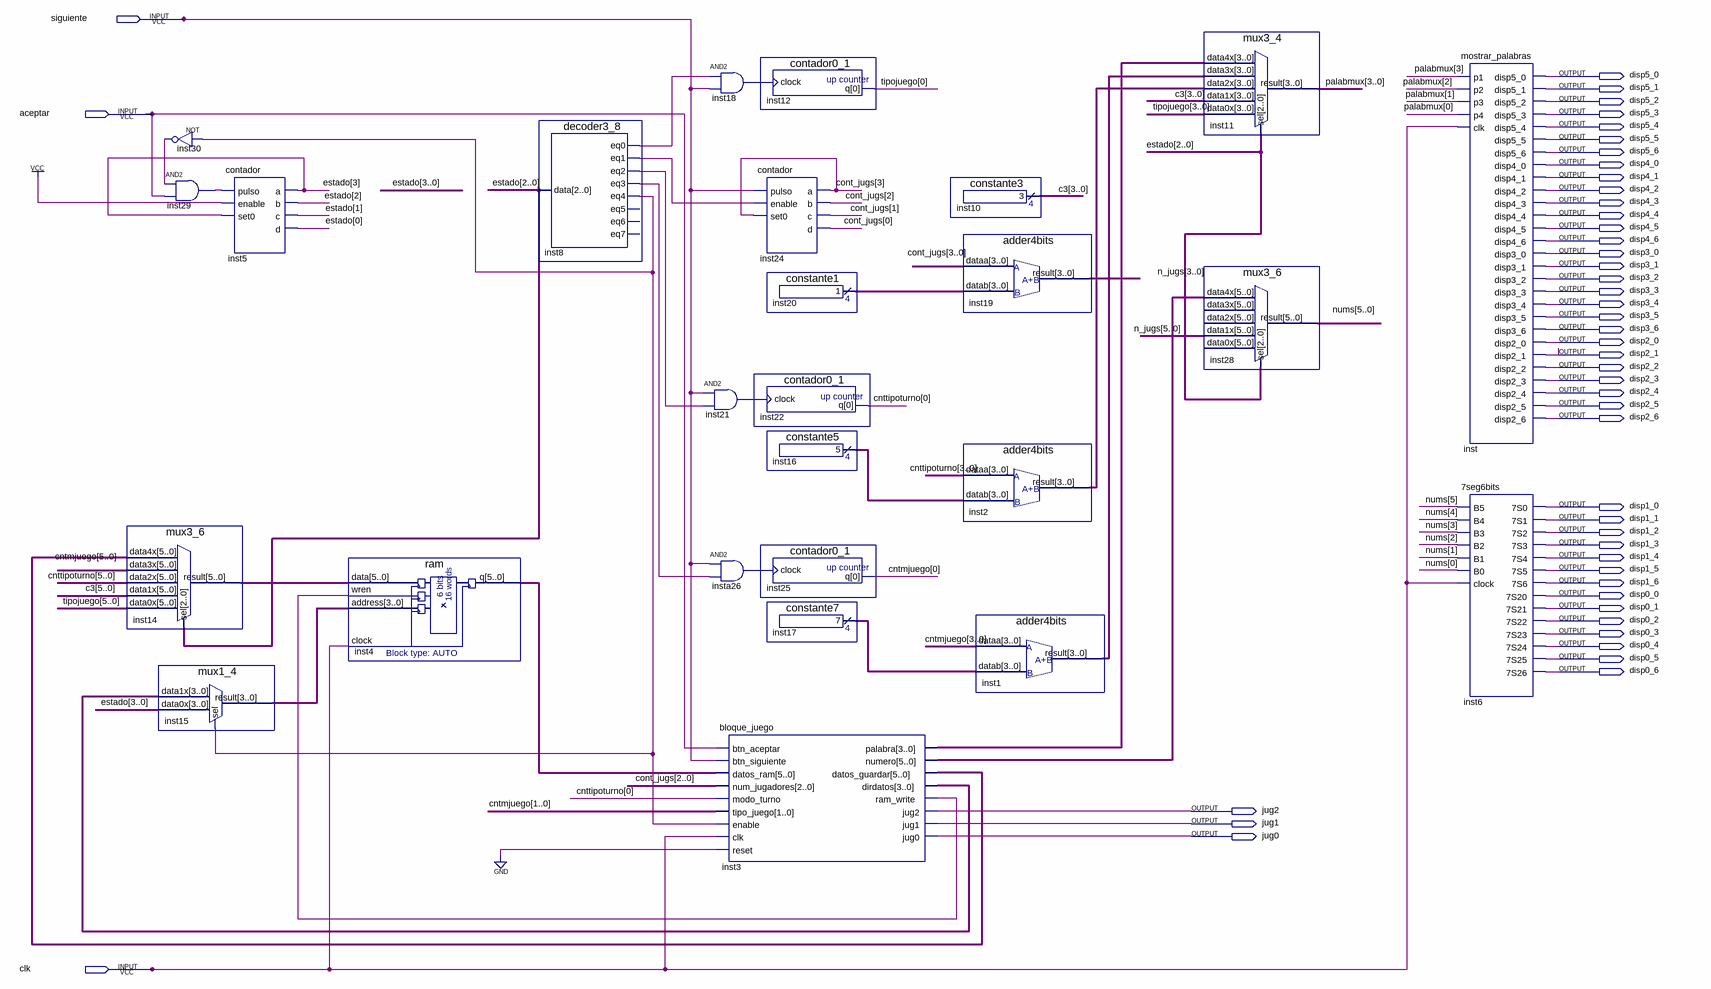
[diagram p0: schematic sheet]
// Quartus schematic asistente.bdf as structural Verilog: 26 symbols, 48 pins
module asistente (
  input  siguiente,
  input  aceptar,
  input  clk,
  output disp5_0,
  output disp5_1,
  output disp5_2,
  output disp5_3,
  output disp5_4,
  output disp5_5,
  output disp5_6,
  output disp4_0,
  output disp4_1,
  output disp4_2,
  output disp4_3,
  output disp4_4,
  output disp4_5,
  output disp4_6,
  output disp3_0,
  output disp3_1,
  output disp3_2,
  output disp3_3,
  output disp3_4,
  output disp3_5,
  output disp3_6,
  output disp2_0,
  output disp2_1,
  output disp2_2,
  output disp2_3,
  output disp2_4,
  output disp2_5,
  output disp2_6,
  output disp1_0,
  output disp1_1,
  output disp1_2,
  output disp1_3,
  output disp1_4,
  output disp1_5,
  output disp1_6,
  output disp0_0,
  output disp0_1,
  output disp0_2,
  output disp0_3,
  output disp0_4,
  output disp0_5,
  output disp0_6,
  output jug2,
  output jug1,
  output jug0
);

  wire inst3_ram_write, inst8_eq0, inst8_eq1, inst8_eq2, inst8_eq3, inst8_eq4, inst18_out, inst21_out,
       inst29_out, inst30_out, insta26_out;
  wire [3:0] cont_jugs, estado, inst1_result, inst2_result, inst3_dirdatos, inst3_palabra, inst15_result,
       inst16_result, inst17_result, inst20_result, palabmux;
  wire [5:0] c3, cntmjuego, cnttipoturno, inst3_datos_guardar, inst3_numero, inst4_q, inst14_result, n_jugs,
       nums, tipojuego;

  mux3_6 inst14 (
    .data4x(inst3_datos_guardar), .data3x(cntmjuego), .data2x(cnttipoturno), .data1x(c3), .data0x(tipojuego),
    .sel(estado[2:0]), .result(inst14_result));
  not inst30 (inst30_out, inst8_eq4);
  and inst29 (inst29_out, inst30_out, aceptar);
  mux1_4 inst15 (.data1x(inst3_dirdatos), .data0x(estado), .sel(inst8_eq4), .result(inst15_result));
  contador inst5 (
    .pulso(inst29_out), .enable(1'b1), .set0(estado[3]), .a(estado[3]), .b(estado[2]), .c(estado[1]),
    .d(estado[0]));
  ram inst4 (.data(inst14_result), .wren(inst3_ram_write), .address(inst15_result), .clock(clk), .q(inst4_q));
  decoder3_8 inst8 (
    .data(estado[2:0]), .eq0(inst8_eq0), .eq1(inst8_eq1), .eq2(inst8_eq2), .eq3(inst8_eq3), .eq4(inst8_eq4));  // open: eq5, eq6, eq7
  and inst21 (inst21_out, siguiente, inst8_eq2);
  and inst18 (inst18_out, inst8_eq0, siguiente);
  contador inst24 (
    .pulso(siguiente), .enable(inst8_eq1), .set0(cont_jugs[3]), .a(cont_jugs[3]), .b(cont_jugs[2]),
    .c(cont_jugs[1]), .d(cont_jugs[0]));
  contador0_1 inst22 (.clock(inst21_out), .q(cnttipoturno[0]));
  and insta26 (insta26_out, siguiente, inst8_eq3);
  bloque_juego inst3 (
    .btn_aceptar(aceptar), .btn_siguiente(siguiente), .datos_ram(inst4_q), .num_jugadores(cont_jugs[2:0]),
    .modo_turno(cnttipoturno[0]), .tipo_juego(cntmjuego[1:0]), .enable(inst8_eq4), .clk(clk), .reset(1'b0),
    .palabra(inst3_palabra), .numero(inst3_numero), .datos_guardar(inst3_datos_guardar),
    .dirdatos(inst3_dirdatos), .ram_write(inst3_ram_write), .jug2(jug2), .jug1(jug1), .jug0(jug0));
  contador0_1 inst12 (.clock(inst18_out), .q(tipojuego[0]));
  constante1 inst20 (.result(inst20_result));
  constante5 inst16 (.result(inst16_result));
  contador0_1 inst25 (.clock(insta26_out), .q(cntmjuego[0]));
  constante7 inst17 (.result(inst17_result));
  constante3 inst10 (.result(c3[3:0]));
  adder4bits inst19 (.dataa(cont_jugs), .datab(inst20_result), .result(n_jugs[3:0]));
  adder4bits inst2 (.dataa(cnttipoturno[3:0]), .datab(inst16_result), .result(inst2_result));
  adder4bits inst1 (.dataa(cntmjuego[3:0]), .datab(inst17_result), .result(inst1_result));
  mux3_4 inst11 (
    .data4x(inst3_palabra), .data3x(inst1_result), .data2x(inst2_result), .data1x(c3[3:0]),
    .data0x(tipojuego[3:0]), .sel(estado[2:0]), .result(palabmux));
  mux3_6 inst28 (
    .data4x(inst3_numero), .data1x(n_jugs), .sel(estado[2:0]), .result(nums));  // open: data3x, data2x, data0x
  mostrar_palabras inst (
    .p1(palabmux[3]), .p2(palabmux[2]), .p3(palabmux[1]), .p4(palabmux[0]), .clk(clk), .disp5_0(disp5_0),
    .disp5_1(disp5_1), .disp5_2(disp5_2), .disp5_3(disp5_3), .disp5_4(disp5_4), .disp5_5(disp5_5),
    .disp5_6(disp5_6), .disp4_0(disp4_0), .disp4_1(disp4_1), .disp4_2(disp4_2), .disp4_3(disp4_3),
    .disp4_4(disp4_4), .disp4_5(disp4_5), .disp4_6(disp4_6), .disp3_0(disp3_0), .disp3_1(disp3_1),
    .disp3_2(disp3_2), .disp3_3(disp3_3), .disp3_4(disp3_4), .disp3_5(disp3_5), .disp3_6(disp3_6),
    .disp2_0(disp2_0), .disp2_1(disp2_1), .disp2_2(disp2_2), .disp2_3(disp2_3), .disp2_4(disp2_4),
    .disp2_5(disp2_5), .disp2_6(disp2_6));
  \7seg6bits  inst6 (
    .B5(nums[5]), .B4(nums[4]), .B3(nums[3]), .B2(nums[2]), .B1(nums[1]), .B0(nums[0]), .clock(clk),
    .\7S0 (disp1_0), .\7S1 (disp1_1), .\7S2 (disp1_2), .\7S3 (disp1_3), .\7S4 (disp1_4), .\7S5 (disp1_5),
    .\7S6 (disp1_6), .\7S20 (disp0_0), .\7S21 (disp0_1), .\7S22 (disp0_2), .\7S23 (disp0_3),
    .\7S24 (disp0_4), .\7S25 (disp0_5), .\7S26 (disp0_6));
endmodule
